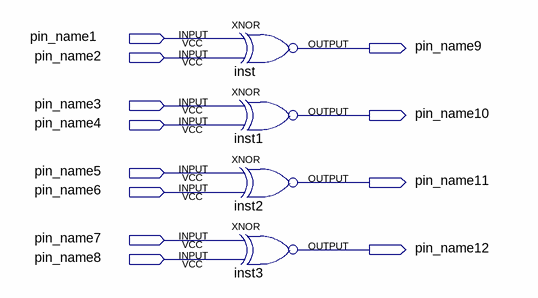
[diagram p0: schematic sheet]
// Quartus schematic xnor4x4.bdf as structural Verilog: 4 symbols, 12 pins
module xnor4x4 (
  input  pin_name1,
  input  pin_name2,
  input  pin_name3,
  input  pin_name4,
  input  pin_name5,
  input  pin_name6,
  input  pin_name7,
  input  pin_name8,
  output pin_name9,
  output pin_name10,
  output pin_name11,
  output pin_name12
);

  xnor inst (pin_name9, pin_name1, pin_name2);
  xnor inst1 (pin_name10, pin_name3, pin_name4);
  xnor inst2 (pin_name11, pin_name5, pin_name6);
  xnor inst3 (pin_name12, pin_name7, pin_name8);
endmodule
